# EAGLE design HighVoltageMeasurementModule_1000V (EAGLE 9.6.2)
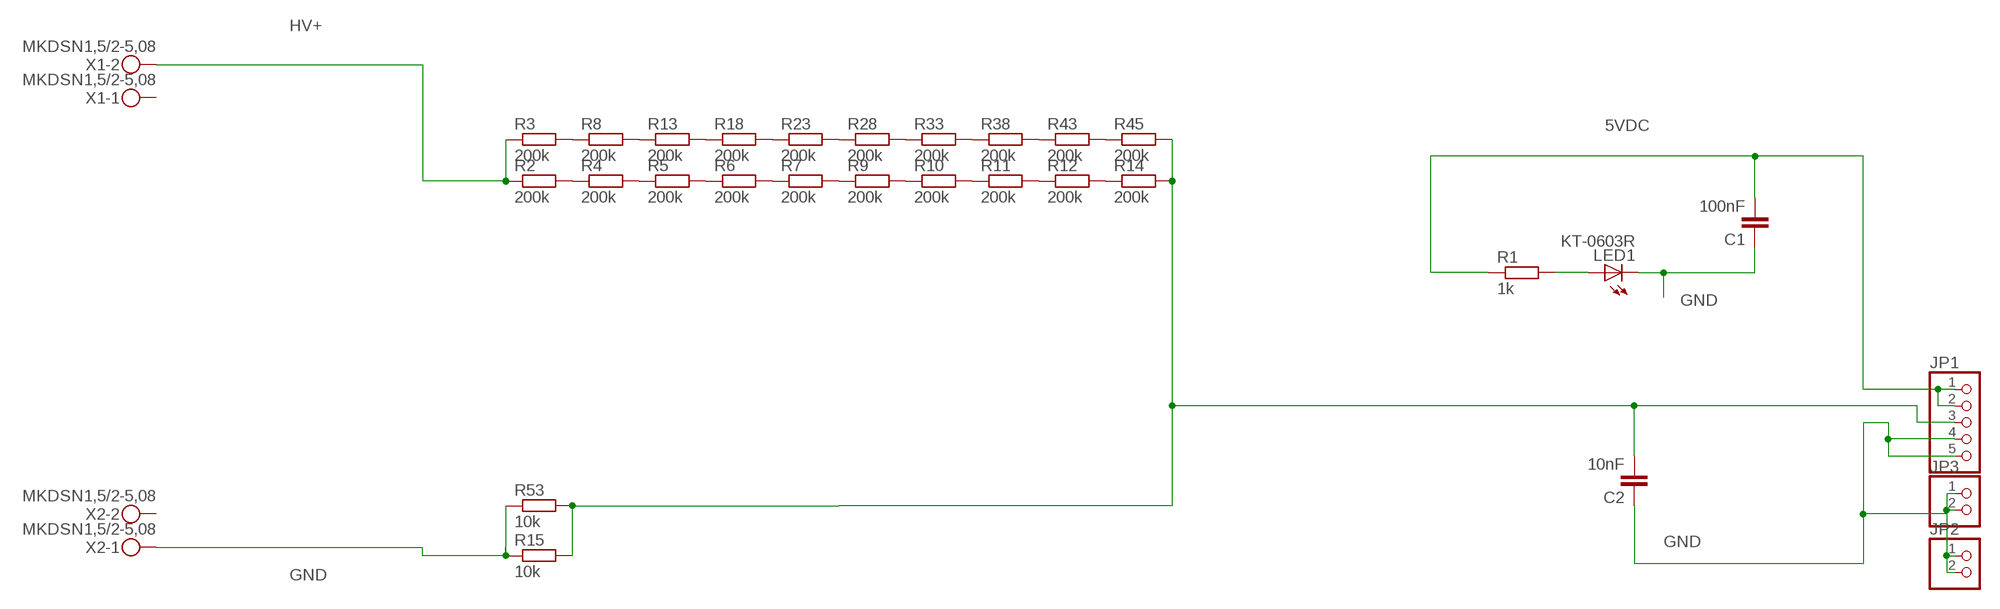
[diagram p0: schematic, sheet 1]

## Parts
C1  100nF  C-EUC0805  [C0805]
C2  10nF  C-EUC0805  [C0805]
JP1  PINHD-1X5  [1X05]
JP2  PINHD-1X2  [1X02]
JP3  PINHD-1X2  [1X02]
LED1  KT-0603R  LEDCHIPLED_0603  [CHIPLED_0603]
R1  1k  R-EU_R0805  [R0805]
R2  200k  R-EU_R0805  [R0805]
R3  200k  R-EU_R0805  [R0805]
R4  200k  R-EU_R0805  [R0805]
R5  200k  R-EU_R0805  [R0805]
R6  200k  R-EU_R0805  [R0805]
R7  200k  R-EU_R0805  [R0805]
R8  200k  R-EU_R0805  [R0805]
R9  200k  R-EU_R0805  [R0805]
R10  200k  R-EU_R0805  [R0805]
R11  200k  R-EU_R0805  [R0805]
R12  200k  R-EU_R0805  [R0805]
R13  200k  R-EU_R0805  [R0805]
R14  200k  R-EU_R0805  [R0805]
R15  10k  R-EU_R0805  [R0805]
R18  200k  R-EU_R0805  [R0805]
R23  200k  R-EU_R0805  [R0805]
R28  200k  R-EU_R0805  [R0805]
R33  200k  R-EU_R0805  [R0805]
R38  200k  R-EU_R0805  [R0805]
R43  200k  R-EU_R0805  [R0805]
R45  200k  R-EU_R0805  [R0805]
R53  10k  R-EU_R0805  [R0805]
X1  MKDSN1,5/2-5,08  [MKDSN1,5/2-5,08]
X2  MKDSN1,5/2-5,08  [MKDSN1,5/2-5,08]

## Nets
5VDC: C1.2 JP1.1 JP1.2 R1.1
GND: C1.1 C2.1 JP1.4 JP1.5 JP2.1 JP2.2 JP3.1 JP3.2 LED1.C R15.1 R53.1 X2.1
HV+: R2.1 R3.1 X1.2
N$1: R2.2 R4.1
N$2: R4.2 R5.1
N$3: R5.2 R6.1
N$4: R6.2 R7.1
N$5: LED1.A R1.2
N$7: R7.2 R9.1
N$8: R3.2 R8.1
N$9: R8.2 R13.1
N$10: R9.2 R10.1
N$11: R10.2 R11.1
N$12: R11.2 R12.1
N$13: R12.2 R14.1
N$14: R13.2 R18.1
N$15: C2.2 JP1.3 R14.2 R15.2 R45.2 R53.2
N$19: R18.2 R23.1
N$24: R23.2 R28.1
N$29: R28.2 R33.1
N$34: R33.2 R38.1
N$39: R38.2 R43.1
N$41: R43.2 R45.1
Unconnected: X1.1 X2.2

## Library data of the parts
C1 C2 = rcl:C-EU: CAPACITOR, European symbol
JP1 = pinhead:PINHD-1X5: PIN HEADER
JP2 JP3 = pinhead:PINHD-1X2: PIN HEADER
LED1 = led:LED: LED OSRAM: - CHIPLED LG R971, LG N971, LY N971, LG Q971, LY Q971, LO R971, LY R971 LH N974, LH R974 LS Q976, LO Q976, LY Q976 LO Q996 - Hyper CHIPLED LW Q18S LB Q993, LB Q99A, LB R99A - SideLED LS A670, LO A670, LY A670, LG A670, LP A670 LB A673, LV A673, LT A673, LW A673 LH A674 LY A675 LS A676, LA A676, LO A676, LY A676, LW A676 LS A679, LY A679, LG A679 - Hyper Micro SIDELED® LS Y876, LA Y876, LO Y876, LY Y876 LT Y87S - SmartLED LW L88C, LW L88S LB L89C, LB L89S, LG L890 LS L89K, LO L89K, LY L89K LS L896, LA L896, LO L896, LY L896 - TOPLED LS T670, LO T670, LY T670, LG T670, LP T670 LSG T670, LSP T670, LSY T670, LOP T670, LYG T670 LG T671, LOG T671, LSG T671 LB T673, LV T673, LT T673, LW T673 LH T674 LS T676, LA T676, LO T676, LY T676, LB T676, LH T676, LSB T676, LW T676 LB T67C, LV T67C, LT T67C, LS T67K, LO T67K, LY T67K, LW E67C LS E67B, LA E67B, LO E67B, LY E67B, LB E67C, LV E67C, LT E67C LW T67C LS T679, LY T679, LG T679 LS T770, LO T770, LY T770, LG T770, LP T770 LB T773, LV T773, LT T773, LW T773 LH T774 LS E675, LA E675, LY E675, LS T675 LS T776, LA T776, LO T776, LY T776, LB T776 LHGB T686 LT T68C, LB T68C - Hyper Mini TOPLED® LB M676 - Mini TOPLED Santana® LG M470 LS M47K, LO M47K, LY M47K Source: http://www.osram.convergy.de LUXEON: - LUMILED® LXK2-PW12-R00, LXK2-PW12-S00, LXK2-PW14-U00, LXK2-PW14-V00 LXK2-PM12-R00, LXK2-PM12-S00, LXK2-PM14-U00 LXK2-PE12-Q00, LXK2-PE12-R00, LXK2-PE12-S00, LXK2-PE14-T00, LXK2-PE14-U00 LXK2-PB12-K00, LXK2-PB12-L00, LXK2-PB12-M00, LXK2-PB14-N00, LXK2-PB14-P00, LXK2-PB14-Q00 LXK2-PR12-L00, LXK2-PR12-M00, LXK2-PR14-Q00, LXK2-PR14-R00 LXK2-PD12-Q00, LXK2-PD12-R00, LXK2-PD12-S00 LXK2-PH12-R00, LXK2-PH12-S00 LXK2-PL12-P00, LXK2-PL12-Q00, LXK2-PL12-R00 Source: www.luxeon.com KINGBRIGHT: KA-3528ASYC Source: www.kingbright.com
R1-R15 R18 R23 R28 R33 R38 R43 R45 R53 = rcl:R-EU_: RESISTOR, European symbol
X1 X2 = con-phoenix-508:MKDSN1,5/2-5,08: MKDSN 1,5/ 2-5,08 Printklemme Nennstrom: 13,5 A Nennspannung: 250 V Rastermaß: 5,08 mm Polzahl: 2 Anschlussart: Schraubanschluss Montage: Löten Anschlussrichtung Leiter/Platine: 0 ° Artikelnummer: 1729128 Source: http://eshop.phoenixcontact.com .. 1729128.pdf

## Board
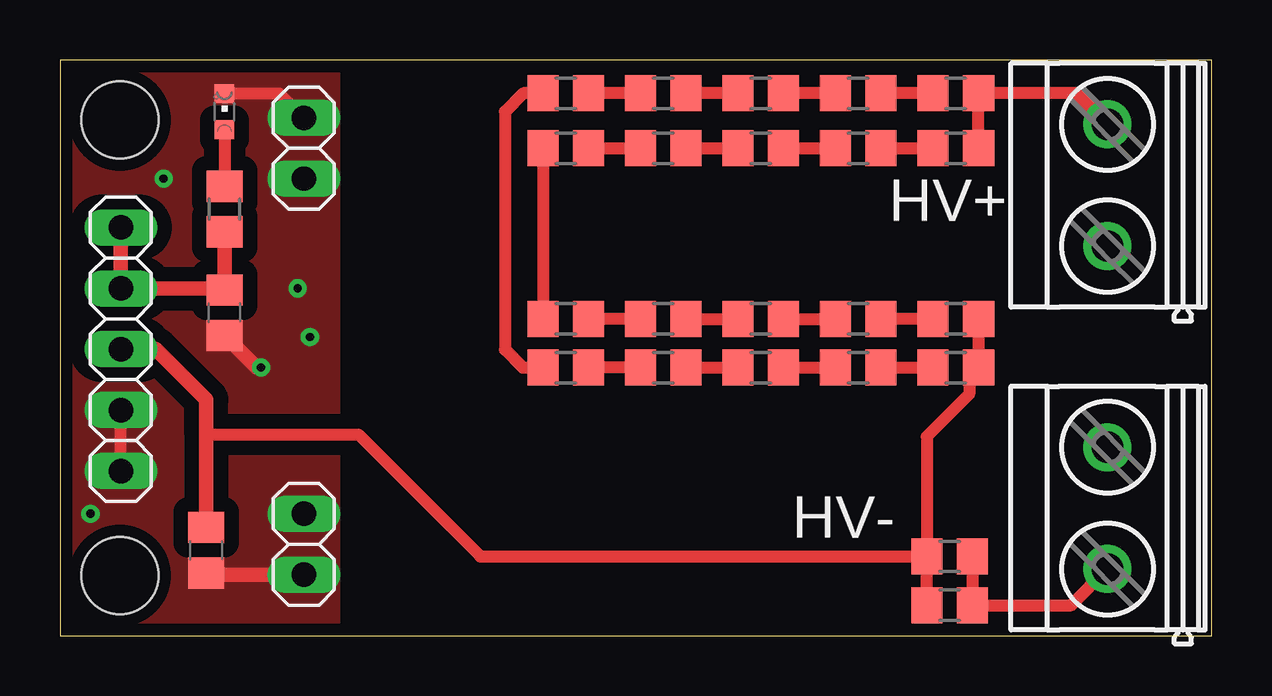
[diagram p1: board, top side]
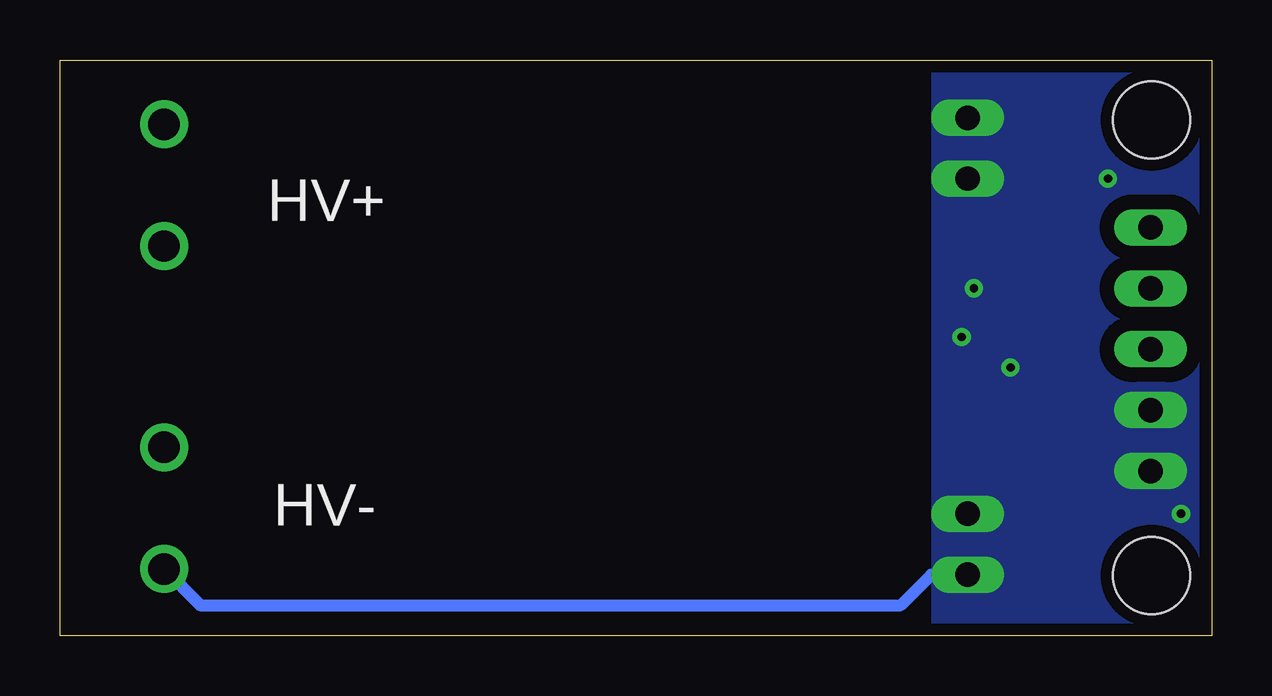
[diagram p2: board, bottom side, seen from below]

Size 48 x 24 mm. Coordinates in mm from the lower left corner, seen from the top.
Outline: 0,0 48,0 48,24 0,24 0,0
Copper layers (1*16): Top 0.035mm / dielectric 1.5mm / Bottom 0.035mm
Design rules "default *": minimum track width 6mil, minimum drill 0.35mm, track to track 24mil, track to pad 24mil, pad to pad 6mil, via to via 6mil, smd to smd 6mil, copper to edge 20mil, drill to drill 6mil, minimum pad ring 10mil, minimum via ring 8mil, stop-mask expansion 4mil, vias tented up to drill 0mil, thermal gap 10mil
Holes 3.2 mm at 2.5,21.5 2.5,2.5

### Footprints (pad centres in the part's own frame; a part is rotated, then mirrored left to right if it is on the bottom)
C0805 = smd 1.3 x 1.5: 1 -0.95,0; 2 0.95,0
1X05 = drill 1.016 long: 1 -5.08,0; 2 -2.54,0; 3 0,0; 4 2.54,0; 5 5.08,0
1X02 = drill 1.016 long: 1 -1.27,0; 2 1.27,0
CHIPLED_0603 = smd 0.8 x 0.8: A 0,-0.75; C 0,0.75
R0805 = smd 1.3 x 1.5: 1 -0.95,0; 2 0.95,0
MKDSN1,5/2-5,08 = drill 1.3 pad 2: 1 -2.561,0.025; 2 2.519,0.025

### Placement (x,y rotation side)
C1  6.86,13.46 90 top
C2  6.1,3.56 90 top
JP1  2.54,11.94 270 top
JP2  10.16,20.32 90 top
JP3  10.16,3.81 270 top
LED1  6.86,21.84 0 top
R1  6.86,17.78 90 top
R2  37.34,20.32 180 top
R3  37.34,22.61 180 top
R4  33.27,20.32 180 top
R5  29.21,20.32 180 top
R6  25.15,20.32 180 top
R7  21.08,20.32 180 top
R8  33.27,22.61 180 top
R9  21.08,13.21 0 top
R10  25.15,13.21 0 top
R11  29.21,13.21 0 top
R12  33.27,13.21 0 top
R13  29.21,22.61 180 top
R14  37.34,13.21 0 top
R15  37.08,1.27 180 top
R18  25.15,22.61 180 top
R23  21.08,22.61 180 top
R28  21.08,11.18 0 top
R33  25.15,11.18 0 top
R38  29.21,11.18 0 top
R43  33.27,11.18 0 top
R45  37.34,11.18 0 top
R53  37.08,3.3 180 top
X1  43.69,18.8 90 top
X2  43.69,5.33 90 top

### Tracks (layer width: path | path; a pad name or v marks a point on that pad's centre or on a via)
5VDC
  Top 0.61: JP1.1 JP1.2 6.79,14.48 C1.2 R1.1
GND  (via drill 0.35)
  Top 0.508: JP2.2 9.16,22.59 LED1.C | JP1.5 JP1.4 | R53.1 R15.1 42.16,1.27 X2.1
  Top 0.61: C2.1 6.16,2.54 JP3.2 | C1.1 8.19,11.18 v8.38,11.18
  Bottom 0.508: X2.1 42.16,1.27 12.95,1.27 11.68,2.54 JP3.2
  other vias: 9.91,14.48 10.41,12.45 4.32,19.05 1.27,5.08
  pour Top (no thermals): -0.76,24.64 11.68,24.64 11.68,-1.27 -0.76,-1.27
  pour Bottom (no thermals): 11.43,25.4 11.68,25.4 11.68,-1.78 -1.02,-1.78 -1.02,25.15 9.91,25.15 10.16,25.4
HV+
  Top 0.508: R2.1 R3.1 42.37,22.61 X1.2
N$1
  Top 0.508: R4.1 R2.2
N$2
  Top 0.508: R5.1 R4.2
N$3
  Top 0.508: R6.1 R5.2
N$4
  Top 0.508: R7.1 R6.2
N$5
  Top 0.508: LED1.A R1.2
N$7
  Top 0.508: R7.2 R9.1
N$8
  Top 0.508: R3.2 R8.1
N$9
  Top 0.508: R8.2 R13.1
N$10
  Top 0.508: R10.1 R9.2
N$11
  Top 0.508: R10.2 R11.1
N$12
  Top 0.508: R11.2 R12.1
N$13
  Top 0.508: R14.1 R12.2
N$14
  Top 0.508: R13.2 R18.1
N$15
  Top 0.508: 6.1,8.38 12.45,8.38 17.53,3.3 R53.2 | R15.2 R53.2 | R14.2 R45.2 37.9,10.79 37.9,10.07 36.13,8.3 R53.2
  Top 0.61: C2.2 6.1,8.38 6.1,9.84 4,11.94 JP1.3
N$19
  Top 0.508: R18.2 R23.1
N$24
  Top 0.508: R23.2 19.3,22.61 18.54,21.84 18.54,11.92 19.29,11.18 R28.1
N$29
  Top 0.508: R33.1 R28.2
N$34
  Top 0.508: R33.2 R38.1
N$39
  Top 0.508: R38.2 R43.1
N$41
  Top 0.508: R43.2 R45.1

### Text on the board
tNames: HV+ | HV-
bNames: HV+ | HV-